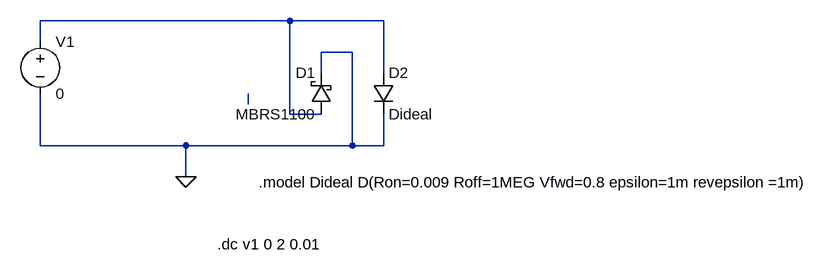
[diagram p0: schematic IdealD.asc]
IdealD.asc, the LTspice schematic file:
Version 4
SHEET 1 1452 680
WIRE 480 304 96 304
WIRE 624 304 480 304
WIRE 96 336 96 304
WIRE 576 352 528 352
WIRE 528 384 528 352
WIRE 624 384 624 304
WIRE 416 432 416 416
WIRE 480 448 480 304
WIRE 528 448 480 448
WIRE 96 496 96 416
WIRE 320 496 96 496
WIRE 576 496 576 352
WIRE 576 496 320 496
WIRE 624 496 624 448
WIRE 624 496 576 496
WIRE 320 544 320 496
FLAG 320 544 0
SYMBOL schottky 544 448 R180
WINDOW 0 24 64 Left 2
WINDOW 3 24 0 Left 2
SYMATTR InstName D1
SYMATTR Value MBRS1100
SYMATTR Description Diode
SYMATTR Type diode
SYMBOL voltage 96 320 R0
SYMATTR InstName V1
SYMATTR Value 0
SYMBOL diode 608 384 R0
SYMATTR InstName D2
SYMATTR Value Dideal
TEXT 368 648 Left 2 !.dc v1 0 2 0.01
TEXT 432 552 Left 2 !.model Dideal D(Ron=0.009 Roff=1MEG Vfwd=0.8 epsilon=1m revepsilon =1m)

The netlist it stands for:
* IdealD.asc
D1 N001 0 MBRS1100
V1 N001 0 0
D2 N001 0 Dideal
.model D D
.lib standard.dio
.dc v1 0 2 0.01
.model Dideal D(Ron=0.009 Roff=1MEG Vfwd=0.8 epsilon=1m revepsilon =1m)
.backanno
.end